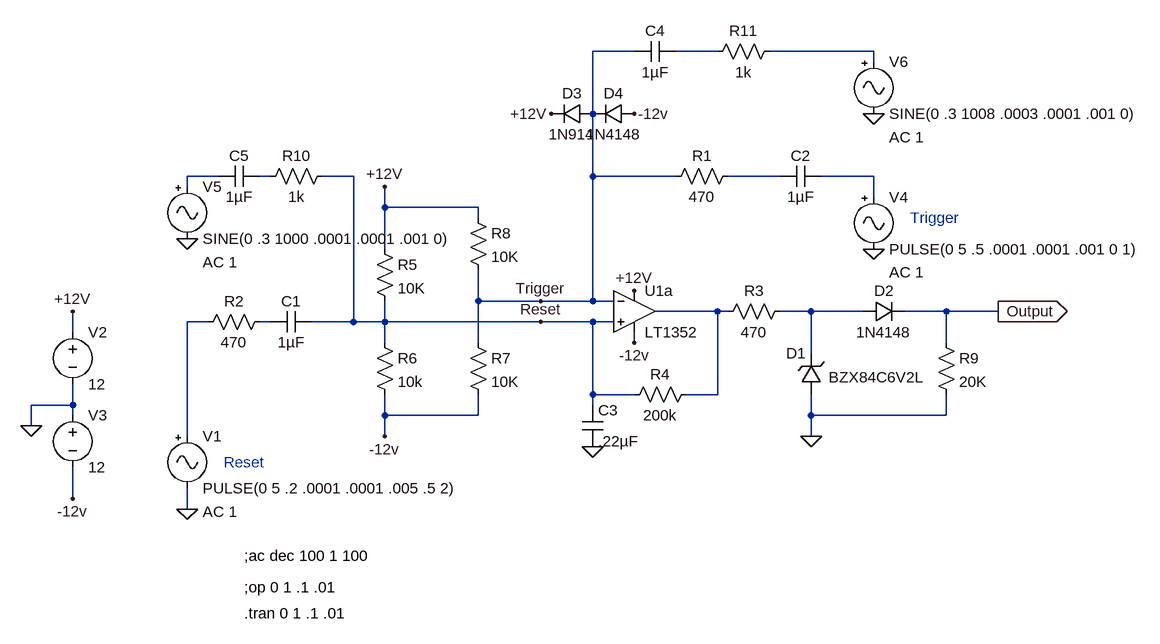
[diagram p0: schematic comparator_flip_flop.asc]
comparator_flip_flop.asc, the LTspice schematic file:
Version 4
SHEET 1 1168 680
WIRE 208 -384 144 -384
WIRE 336 -384 272 -384
WIRE 576 -384 416 -384
WIRE 576 -368 576 -384
WIRE 144 -288 144 -384
WIRE -432 -192 -480 -192
WIRE -352 -192 -368 -192
WIRE -224 -192 -272 -192
WIRE 144 -192 144 -288
WIRE 272 -192 144 -192
WIRE 432 -192 352 -192
WIRE 576 -192 496 -192
WIRE -480 -176 -480 -192
WIRE 576 -160 576 -192
WIRE -176 -144 -176 -176
WIRE -32 -144 -176 -144
WIRE -32 -128 -32 -144
WIRE -176 -80 -176 -144
WIRE -32 0 -32 -48
WIRE 64 0 -32 0
WIRE 144 0 144 -192
WIRE 144 0 64 0
WIRE 176 0 144 0
WIRE 336 16 240 16
WIRE 352 16 336 16
WIRE 480 16 432 16
WIRE 560 16 480 16
WIRE 688 16 624 16
WIRE 768 16 688 16
WIRE -448 32 -480 32
WIRE -352 32 -368 32
WIRE -224 32 -224 -192
WIRE -224 32 -288 32
WIRE -176 32 -176 0
WIRE -176 32 -224 32
WIRE 64 32 -176 32
WIRE 144 32 64 32
WIRE 176 32 144 32
WIRE -656 48 -656 16
WIRE -176 64 -176 32
WIRE -32 64 -32 0
WIRE 208 64 208 48
WIRE 688 64 688 16
WIRE 480 80 480 16
WIRE 144 144 144 32
WIRE 208 144 144 144
WIRE 336 144 336 16
WIRE 336 144 288 144
WIRE -656 160 -656 128
WIRE -656 160 -720 160
WIRE 144 160 144 144
WIRE -656 176 -656 160
WIRE -176 176 -176 144
WIRE -32 176 -32 144
WIRE -32 176 -176 176
WIRE 480 176 480 144
WIRE 688 176 688 144
WIRE 688 176 480 176
WIRE -720 192 -720 160
WIRE -480 208 -480 32
WIRE -176 208 -176 176
WIRE 480 208 480 176
WIRE -656 304 -656 256
WIRE -480 320 -480 288
FLAG -480 320 0
FLAG -720 192 0
FLAG 768 16 Output
IOPIN 768 16 Out
FLAG -656 304 -12v
FLAG 480 208 0
FLAG -656 16 +12V
FLAG 208 -16 +12V
FLAG -176 -176 +12V
FLAG 576 -80 0
FLAG 208 64 -12v
FLAG -176 208 -12v
FLAG 64 32 Reset
FLAG 64 0 Trigger
FLAG -480 -96 0
FLAG 144 224 0
FLAG 576 -288 0
FLAG 80 -288 +12V
FLAG 208 -288 -12v
DATAFLAG -656 288 ""
SYMBOL res 256 -176 R270
WINDOW 0 32 56 VTop 2
WINDOW 3 0 56 VBottom 2
SYMATTR InstName R1
SYMATTR Value 470
SYMATTR SpiceLine tol=1 pwr=0.1
SYMBOL cap -288 16 R90
WINDOW 0 0 32 VBottom 2
WINDOW 3 32 32 VTop 2
SYMATTR InstName C1
SYMATTR Value 1µF
SYMATTR SpiceLine V=100 Irms=3.01 Rser=0.0355863 Lser=0
SYMBOL Misc\\signal -480 192 R0
WINDOW 123 24 132 Left 2
WINDOW 39 0 0 Left 0
SYMATTR Value2 AC 1
SYMATTR InstName V1
SYMATTR Value PULSE(0 5 .2 .0001 .0001 .005 .5 2)
SYMBOL res -352 16 R90
WINDOW 0 0 56 VBottom 2
WINDOW 3 32 56 VTop 2
SYMATTR InstName R2
SYMATTR Value 470
SYMATTR SpiceLine tol=1
SYMBOL res 448 0 R90
WINDOW 0 0 56 VBottom 2
WINDOW 3 32 56 VTop 2
SYMATTR InstName R3
SYMATTR Value 470
SYMATTR SpiceLine tol=1 pwr=.25
SYMBOL Opamps\\LT1352 208 -48 R0
SYMATTR InstName U1a
SYMBOL voltage -656 32 R0
WINDOW 123 0 0 Left 0
WINDOW 39 0 0 Left 0
SYMATTR InstName V2
SYMATTR Value 12
SYMBOL voltage -656 160 R0
WINDOW 123 0 0 Left 0
WINDOW 39 0 0 Left 0
SYMATTR InstName V3
SYMATTR Value 12
SYMBOL zener 496 144 R180
WINDOW 0 24 64 Left 2
WINDOW 3 -158 27 Left 2
SYMATTR InstName D1
SYMATTR Value BZX84C6V2L
SYMBOL res 192 160 R270
WINDOW 0 32 56 VTop 2
WINDOW 3 0 56 VBottom 2
SYMATTR InstName R4
SYMATTR Value 200k
SYMATTR SpiceLine tol=1 pwr=0.1
SYMBOL res -192 -96 R0
SYMATTR InstName R5
SYMATTR Value 10K
SYMATTR SpiceLine tol=1 pwr=0.1
SYMBOL res -192 48 R0
SYMATTR InstName R6
SYMATTR Value 10k
SYMATTR SpiceLine tol=1 pwr=0.1
SYMBOL res -48 48 R0
SYMATTR InstName R7
SYMATTR Value 10K
SYMATTR SpiceLine tol=1 pwr=0.1
SYMBOL res -48 -144 R0
SYMATTR InstName R8
SYMATTR Value 10K
SYMATTR SpiceLine tol=1 pwr=0.1
SYMBOL Misc\\signal 576 -176 R0
WINDOW 123 24 132 Left 2
WINDOW 39 0 0 Left 0
SYMATTR Value2 AC 1
SYMATTR InstName V4
SYMATTR Value PULSE(0 5 .5 .0001 .0001 .001 0 1)
SYMBOL cap 496 -208 R90
WINDOW 0 0 32 VBottom 2
WINDOW 3 32 32 VTop 2
SYMATTR InstName C2
SYMATTR Value 1µF
SYMATTR SpiceLine V=100 Irms=3.01 Rser=0.0355863 Lser=0
SYMBOL diode 560 32 R270
WINDOW 0 32 32 VTop 2
WINDOW 3 0 32 VBottom 2
SYMATTR InstName D2
SYMATTR Value 1N4148
SYMBOL res 672 48 R0
SYMATTR InstName R9
SYMATTR Value 20K
SYMBOL Misc\\signal -480 -192 R0
WINDOW 123 24 132 Left 2
WINDOW 39 0 0 Left 0
SYMATTR Value2 AC 1
SYMATTR InstName V5
SYMATTR Value SINE(0 .3 1000 .0001 .0001 .001 0)
SYMBOL res -368 -176 R270
WINDOW 0 32 56 VTop 2
WINDOW 3 0 56 VBottom 2
SYMATTR InstName R10
SYMATTR Value 1k
SYMATTR SpiceLine tol=1 pwr=0.1
SYMBOL cap 128 160 R0
SYMATTR InstName C3
SYMATTR Value .22µF
SYMATTR SpiceLine V=100 Irms=0 Rser=0 Lser=0
SYMBOL Misc\\signal 576 -384 R0
WINDOW 123 24 132 Left 2
WINDOW 39 0 0 Left 0
SYMATTR Value2 AC 1
SYMATTR InstName V6
SYMATTR Value SINE(0 .3 1008 .0003 .0001 .001 0)
SYMBOL res 320 -368 R270
WINDOW 0 32 56 VTop 2
WINDOW 3 0 56 VBottom 2
SYMATTR InstName R11
SYMATTR Value 1k
SYMATTR SpiceLine tol=1 pwr=0.1
SYMBOL cap 272 -400 R90
WINDOW 0 0 32 VBottom 2
WINDOW 3 32 32 VTop 2
SYMATTR InstName C4
SYMATTR Value 1µF
SYMATTR SpiceLine V=100 Irms=3.01 Rser=0.0355863 Lser=0
SYMBOL cap -368 -208 R90
WINDOW 0 0 32 VBottom 2
WINDOW 3 32 32 VTop 2
SYMATTR InstName C5
SYMATTR Value 1µF
SYMATTR SpiceLine V=100 Irms=3.01 Rser=0.0355863 Lser=0
SYMBOL diode 144 -304 R90
WINDOW 0 0 32 VBottom 2
WINDOW 3 32 32 VTop 2
SYMATTR InstName D3
SYMATTR Value 1N914
SYMBOL diode 208 -304 R90
WINDOW 0 0 32 VBottom 2
WINDOW 3 32 32 VTop 2
SYMATTR InstName D4
SYMATTR Value 1N4148
TEXT -392 392 Left 2 !;ac dec 100 1 100
TEXT -392 440 Left 2 !;op 0 1 .1 .01
TEXT -392 480 Left 2 !.tran 0 1 .1 .01
TEXT 632 -128 Left 2 ;Trigger
TEXT -424 248 Left 2 ;Reset

The netlist it stands for:
* comparator_flip_flop.asc
R1 Trigger N005 470 tol=1 pwr=0.1
C1 Reset N010 1µF V=100 Irms=3.01 Rser=0.0355863 Lser=0
V1 N009 0 PULSE(0 5 .2 .0001 .0001 .005 .5 2) AC 1
R2 N010 N009 470 tol=1
R3 N008 N007 470 tol=1 pwr=.25
XU1a Reset Trigger +12V -12v N007 LT1352  ; pins In+ In- V+ V- OUT
V2 +12V 0 12
V3 0 -12v 12
D1 0 N008 BZX84C6V2L
R4 Reset N007 200k tol=1 pwr=0.1
R5 +12V Reset 10K tol=1 pwr=0.1
R6 Reset -12v 10k tol=1 pwr=0.1
R7 Trigger -12v 10K tol=1 pwr=0.1
R8 +12V Trigger 10K tol=1 pwr=0.1
V4 N006 0 PULSE(0 5 .5 .0001 .0001 .001 0 1) AC 1
C2 N006 N005 1µF V=100 Irms=3.01 Rser=0.0355863 Lser=0
D2 N008 Output 1N4148
R9 Output 0 20K
V5 N003 0 SINE(0 .3 1000 .0001 .0001 .001 0) AC 1
R10 N004 Reset 1k tol=1 pwr=0.1
C3 Reset 0 .22µF V=100 Irms=0 Rser=0 Lser=0
V6 N002 0 SINE(0 .3 1008 .0003 .0001 .001 0) AC 1
R11 N001 N002 1k tol=1 pwr=0.1
C4 N001 Trigger 1µF V=100 Irms=3.01 Rser=0.0355863 Lser=0
C5 N004 N003 1µF V=100 Irms=3.01 Rser=0.0355863 Lser=0
D3 Trigger +12V 1N914
D4 -12v Trigger 1N4148
.model D D
.lib standard.dio
;ac dec 100 1 100
;op 0 1 .1 .01
.tran 0 1 .1 .01
* Trigger
* Reset
.lib LTC.lib
.backanno
.end